# EAGLE design Backplane (EAGLE 9.6.2)
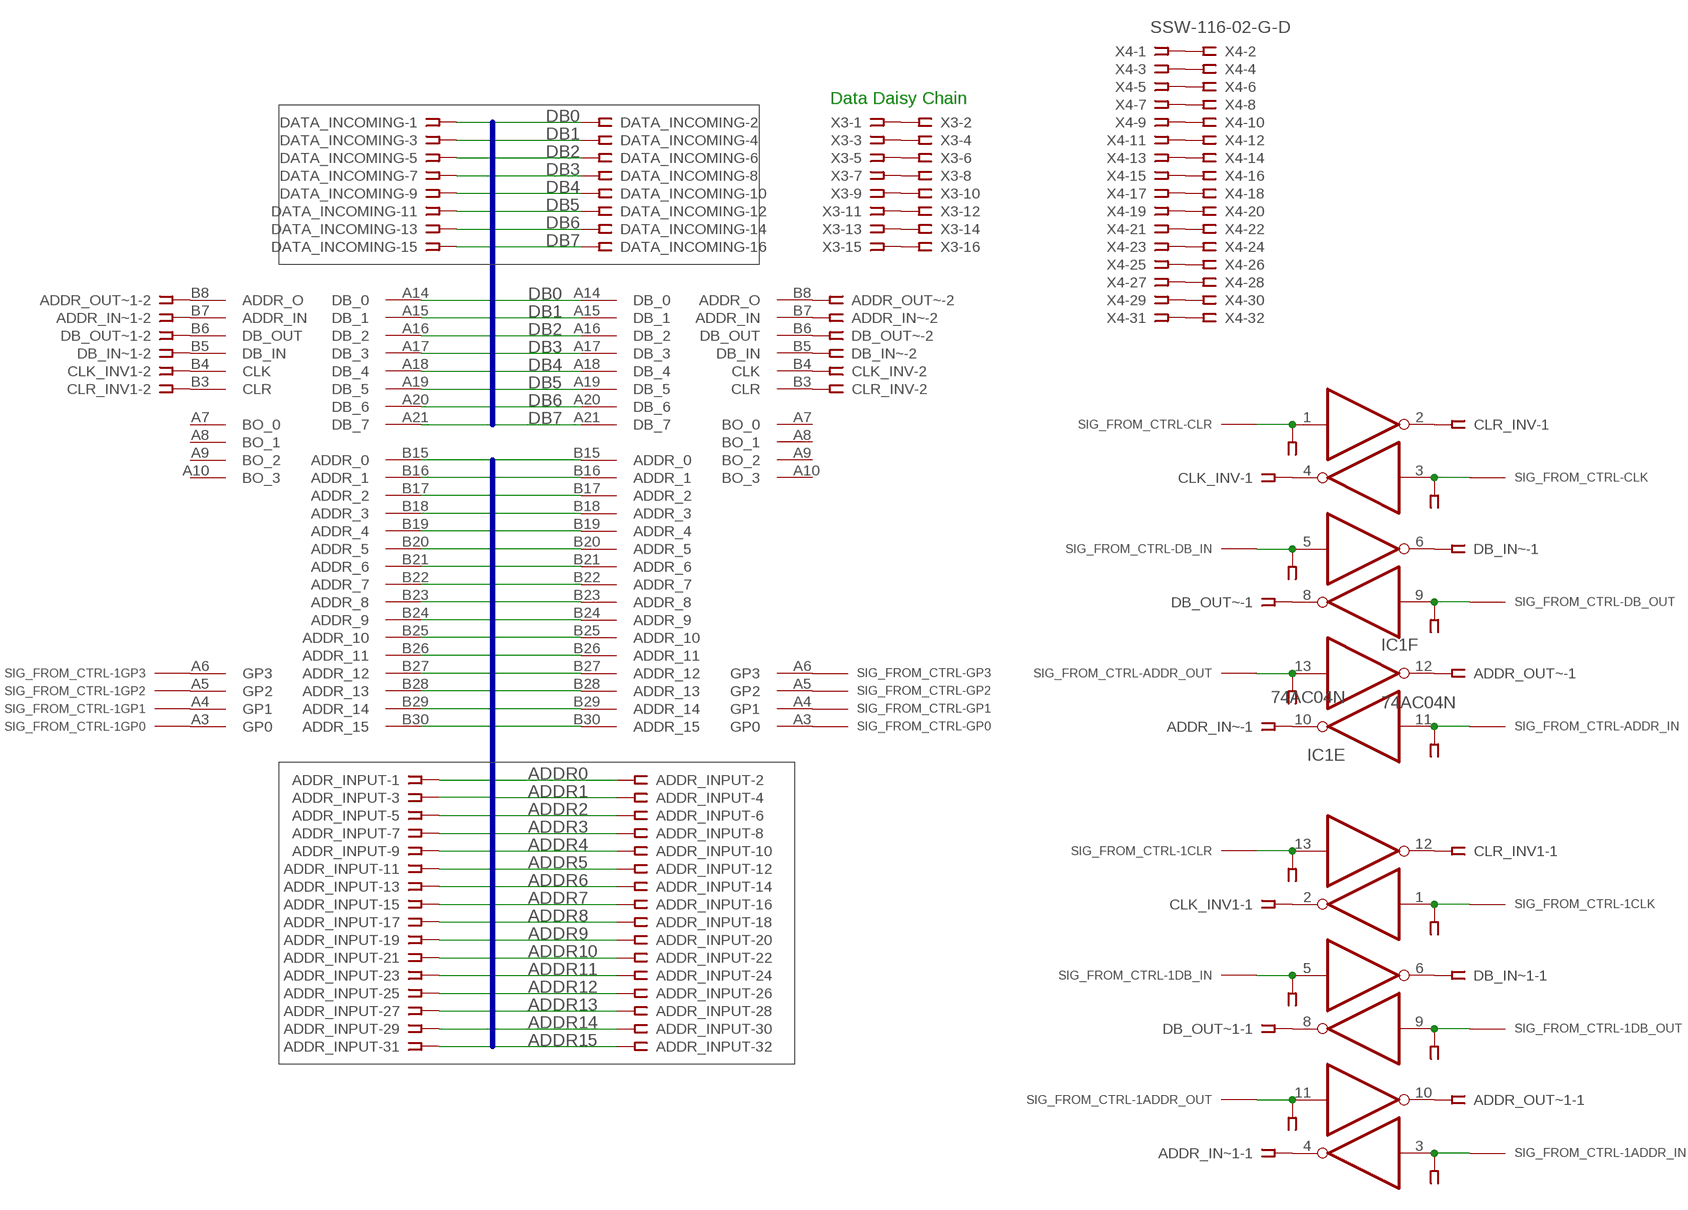
[diagram p0: schematic, sheet 1]

## Parts
ADDR_INPUT  SSW-116-02-G-D  [SSW-116-02-G-D]
ADDR_IN~  SSW-103-02-G-S  [SSW-103-02-G-S]
ADDR_IN~1  SSW-103-02-G-S  [SSW-103-02-G-S]
ADDR_OUT~  SSW-103-02-G-S  [SSW-103-02-G-S]
ADDR_OUT~1  SSW-103-02-G-S  [SSW-103-02-G-S]
CLK_INV  SSW-103-02-G-S  [SSW-103-02-G-S]
CLK_INV1  SSW-103-02-G-S  [SSW-103-02-G-S]
CLR_INV  SSW-103-02-G-S  [SSW-103-02-G-S]
CLR_INV1  SSW-103-02-G-S  [SSW-103-02-G-S]
DATA_INCOMING  SSW-108-02-G-D  [SSW-108-02-G-D]
DB_IN~  SSW-103-02-G-S  [SSW-103-02-G-S]
DB_IN~1  SSW-103-02-G-S  [SSW-103-02-G-S]
DB_OUT~  SSW-103-02-G-S  [SSW-103-02-G-S]
DB_OUT~1  SSW-103-02-G-S  [SSW-103-02-G-S]
IC1  74AC04N  [DIL14]
IC2  74AC04N  [DIL14]
SIG_FROM_CTRL-  CONTROL_SIG-INT  [CONTROL_SIG-INT-FOOT]
SIG_FROM_CTRL-1  CONTROL_SIG-INT  [CONTROL_SIG-INT-FOOT]
U$1  BACKPLATE_INTERFACEHEADER  [PCI_INTERFACE]
U$2  BACKPLATE_INTERFACEHEADER  [PCI_INTERFACE]
X3  SSW-108-02-G-D  [SSW-108-02-G-D]
X4  SSW-116-02-G-D  [SSW-116-02-G-D]

## Nets
ADDR0: ADDR_INPUT.1 ADDR_INPUT.2 U$1.B15(ADDR_0) U$2.B15(ADDR_0)
ADDR1: ADDR_INPUT.3 ADDR_INPUT.4 U$1.B16(ADDR_1) U$2.B16(ADDR_1)
ADDR2: ADDR_INPUT.5 ADDR_INPUT.6 U$1.B17(ADDR_2) U$2.B17(ADDR_2)
ADDR3: ADDR_INPUT.7 ADDR_INPUT.8 U$1.B18(ADDR_3) U$2.B18(ADDR_3)
ADDR4: ADDR_INPUT.9 ADDR_INPUT.10 U$1.B19(ADDR_4) U$2.B19(ADDR_4)
ADDR5: ADDR_INPUT.11 ADDR_INPUT.12 U$1.B20(ADDR_5) U$2.B20(ADDR_5)
ADDR6: ADDR_INPUT.13 ADDR_INPUT.14 U$1.B21(ADDR_6) U$2.B21(ADDR_6)
ADDR7: ADDR_INPUT.15 ADDR_INPUT.16 U$1.B22(ADDR_7) U$2.B22(ADDR_7)
ADDR8: ADDR_INPUT.17 ADDR_INPUT.18 U$1.B23(ADDR_8) U$2.B23(ADDR_8)
ADDR9: ADDR_INPUT.19 ADDR_INPUT.20 U$1.B24(ADDR_9) U$2.B24(ADDR_9)
ADDR10: ADDR_INPUT.21 ADDR_INPUT.22 U$1.B25(ADDR_10) U$2.B25(ADDR_10)
ADDR11: ADDR_INPUT.23 ADDR_INPUT.24 U$1.B26(ADDR_11) U$2.B26(ADDR_11)
ADDR12: ADDR_INPUT.25 ADDR_INPUT.26 U$1.B27(ADDR_12) U$2.B27(ADDR_12)
ADDR13: ADDR_INPUT.27 ADDR_INPUT.28 U$1.B28(ADDR_13) U$2.B28(ADDR_13)
ADDR14: ADDR_INPUT.29 ADDR_INPUT.30 U$1.B29(ADDR_14) U$2.B29(ADDR_14)
ADDR15: ADDR_INPUT.31 ADDR_INPUT.32 U$1.B30(ADDR_15) U$2.B30(ADDR_15)
DB0: DATA_INCOMING.1 DATA_INCOMING.2 U$1.A14(DB_0) U$2.A14(DB_0)
DB1: DATA_INCOMING.3 DATA_INCOMING.4 U$1.A15(DB_1) U$2.A15(DB_1)
DB2: DATA_INCOMING.5 DATA_INCOMING.6 U$1.A16(DB_2) U$2.A16(DB_2)
DB3: DATA_INCOMING.7 DATA_INCOMING.8 U$1.A17(DB_3) U$2.A17(DB_3)
DB4: DATA_INCOMING.9 DATA_INCOMING.10 U$1.A18(DB_4) U$2.A18(DB_4)
DB5: DATA_INCOMING.11 DATA_INCOMING.12 U$1.A19(DB_5) U$2.A19(DB_5)
DB6: DATA_INCOMING.13 DATA_INCOMING.14 U$1.A20(DB_6) U$2.A20(DB_6)
DB7: DATA_INCOMING.15 DATA_INCOMING.16 U$1.A21(DB_7) U$2.A21(DB_7)
N$1: CLR_INV.2 U$2.B3(CLR)
N$2: CLR_INV.3 IC1.1(A:I) SIG_FROM_CTRL-.CLR
N$3: CLK_INV.2 U$2.B4(CLK)
N$4: DB_IN~.2 U$2.B5(DB_IN)
N$5: DB_OUT~.2 U$2.B6(DB_OUT)
N$6: SIG_FROM_CTRL-.GP0 U$2.A3(GP0)
N$7: SIG_FROM_CTRL-.GP1 U$2.A4(GP1)
N$8: CLK_INV.3 IC1.3(B:I) SIG_FROM_CTRL-.CLK
N$9: DB_IN~.3 IC1.5(C:I) SIG_FROM_CTRL-.DB_IN
N$10: DB_OUT~.3 IC1.9(D:I) SIG_FROM_CTRL-.DB_OUT
N$11: SIG_FROM_CTRL-.GP2 U$2.A5(GP2)
N$12: SIG_FROM_CTRL-.GP3 U$2.A6(GP3)
N$13: ADDR_OUT~.3 IC1.13(F:I) SIG_FROM_CTRL-.ADDR_OT
N$14: ADDR_IN~.1 IC1.10(E:O)
N$15: CLR_INV.1 IC1.2(A:O)
N$16: CLK_INV.1 IC1.4(B:O)
N$17: DB_IN~.1 IC1.6(C:O)
N$18: DB_OUT~.1 IC1.8(D:O)
N$19: ADDR_IN~.3 IC1.11(E:I) SIG_FROM_CTRL-.ADDR_IN
N$20: ADDR_OUT~.1 IC1.12(F:O)
N$21: ADDR_OUT~.2 U$2.B8(ADDR_O)
N$22: ADDR_IN~.2 U$2.B7(ADDR_IN)
N$33: X3.1 X3.2
N$34: X3.3 X3.4
N$35: X3.5 X3.6
N$36: X3.7 X3.8
N$37: X3.9 X3.10
N$38: X3.11 X3.12
N$39: X3.13 X3.14
N$40: X3.15 X3.16
N$41: X4.1 X4.2
N$42: X4.3 X4.4
N$43: X4.5 X4.6
N$44: X4.7 X4.8
N$45: X4.9 X4.10
N$46: X4.11 X4.12
N$47: X4.13 X4.14
N$48: X4.15 X4.16
N$49: X4.17 X4.18
N$50: X4.19 X4.20
N$51: X4.21 X4.22
N$52: X4.23 X4.24
N$53: X4.25 X4.26
N$54: X4.27 X4.28
N$55: X4.29 X4.30
N$56: X4.31 X4.32
N$57: CLR_INV1.3 IC2.13(F:I) SIG_FROM_CTRL-1.CLR
N$58: CLK_INV1.3 IC2.1(A:I) SIG_FROM_CTRL-1.CLK
N$59: DB_IN~1.3 IC2.5(C:I) SIG_FROM_CTRL-1.DB_IN
N$60: DB_OUT~1.3 IC2.9(D:I) SIG_FROM_CTRL-1.DB_OUT
N$61: CLK_INV1.1 IC2.2(A:O)
N$62: ADDR_IN~1.1 IC2.4(B:O)
N$63: DB_IN~1.1 IC2.6(C:O)
N$64: DB_OUT~1.1 IC2.8(D:O)
N$65: ADDR_OUT~1.3 IC2.11(E:I) SIG_FROM_CTRL-1.ADDR_OT
N$66: ADDR_IN~1.3 IC2.3(B:I) SIG_FROM_CTRL-1.ADDR_IN
N$67: ADDR_OUT~1.1 IC2.10(E:O)
N$68: CLR_INV1.1 IC2.12(F:O)
N$79: CLK_INV1.2 U$1.B4(CLK)
N$80: CLR_INV1.2 U$1.B3(CLR)
N$81: DB_IN~1.2 U$1.B5(DB_IN)
N$82: DB_OUT~1.2 U$1.B6(DB_OUT)
N$83: ADDR_OUT~1.2 U$1.B8(ADDR_O)
N$84: ADDR_IN~1.2 U$1.B7(ADDR_IN)
N$85: SIG_FROM_CTRL-1.GP0 U$1.A3(GP0)
N$86: SIG_FROM_CTRL-1.GP1 U$1.A4(GP1)
N$87: SIG_FROM_CTRL-1.GP2 U$1.A5(GP2)
N$88: SIG_FROM_CTRL-1.GP3 U$1.A6(GP3)
Unconnected: U$1.A1 U$1.A7(BO_0) U$1.A8(BO_1) U$1.A9(BO_2) U$1.A10(BO_3) U$1.A11 U$1.A12 U$1.A13 U$1.A22 U$1.A23 U$1.A24 U$1.A25 U$1.A26 U$1.A27 U$1.A28 U$1.A29 U$1.A30 U$1.A32 U$1.B1 U$1.B9 U$1.B10 U$1.B11 U$1.B12 U$1.B13 U$1.B14 U$1.B32 U$2.A1 U$2.A7(BO_0) U$2.A8(BO_1) U$2.A9(BO_2) U$2.A10(BO_3) U$2.A11 U$2.A12 U$2.A13 U$2.A22 U$2.A23 U$2.A24 U$2.A25 U$2.A26 U$2.A27 U$2.A28 U$2.A29 U$2.A30 U$2.A32 U$2.B1 U$2.B9 U$2.B10 U$2.B11 U$2.B12 U$2.B13 U$2.B14 U$2.B32

## Buses
DB[0..7]
ADDR[0..15]

## Notes on the sheet
- Data Daisy Chain

## Power pins joined to a net without a drawn wire
GND: IC1.7(P:GND) IC2.7(P:GND) SIG_FROM_CTRL-1.GND SIG_FROM_CTRL-.GND U$1.B2(GND) U$1.B31(GND) U$2.B2(GND) U$2.B31(GND)
VCC: IC1.14(P:VCC) IC2.14(P:VCC) SIG_FROM_CTRL-1.VCC SIG_FROM_CTRL-.VCC U$1.A2(VCC) U$1.A31(VCC) U$2.A2(VCC) U$2.A31(VCC)

## Library data of the parts
ADDR_INPUT X4 = con-samtec:SSW-116-02-G: THROUGH-HOLE .025" SQ POST SOCKET Source: Samtec SSW.pdf; MF: Samtec Inc.; MPN: SSW-116-02-G-D; OC_FARNELL: unknown; OC_NEWARK: 11P9577
ADDR_IN~ ADDR_IN~1 ADDR_OUT~ ADDR_OUT~1 CLK_INV CLK_INV1 CLR_INV CLR_INV1 DB_IN~ DB_IN~1 DB_OUT~ DB_OUT~1 = con-samtec:SSW-103-02-G-S: THROUGH-HOLE .025" SQ POST SOCKET Source: Samtec SSW.pdf; MF: Samtec Inc.; MPN: SSW-103-02-G-S; OC_FARNELL: unknown; OC_NEWARK: 11P9367
DATA_INCOMING X3 = con-samtec:SSW-108-02-G: THROUGH-HOLE .025" SQ POST SOCKET Source: Samtec SSW.pdf; MF: Samtec Inc.; MPN: SSW-108-02-G-D; OC_FARNELL: unknown; OC_NEWARK: 85K7646
IC1 IC2 = 74xx-eu:74*04: Hex INVERTER
SIG_FROM_CTRL- SIG_FROM_CTRL-1 = Computer:CONTROL_SIG-INT
U$1 U$2 = Computer:BACKPLATE_INTERFACE

## Net classes
0 default: width 0.152 mm

## Board
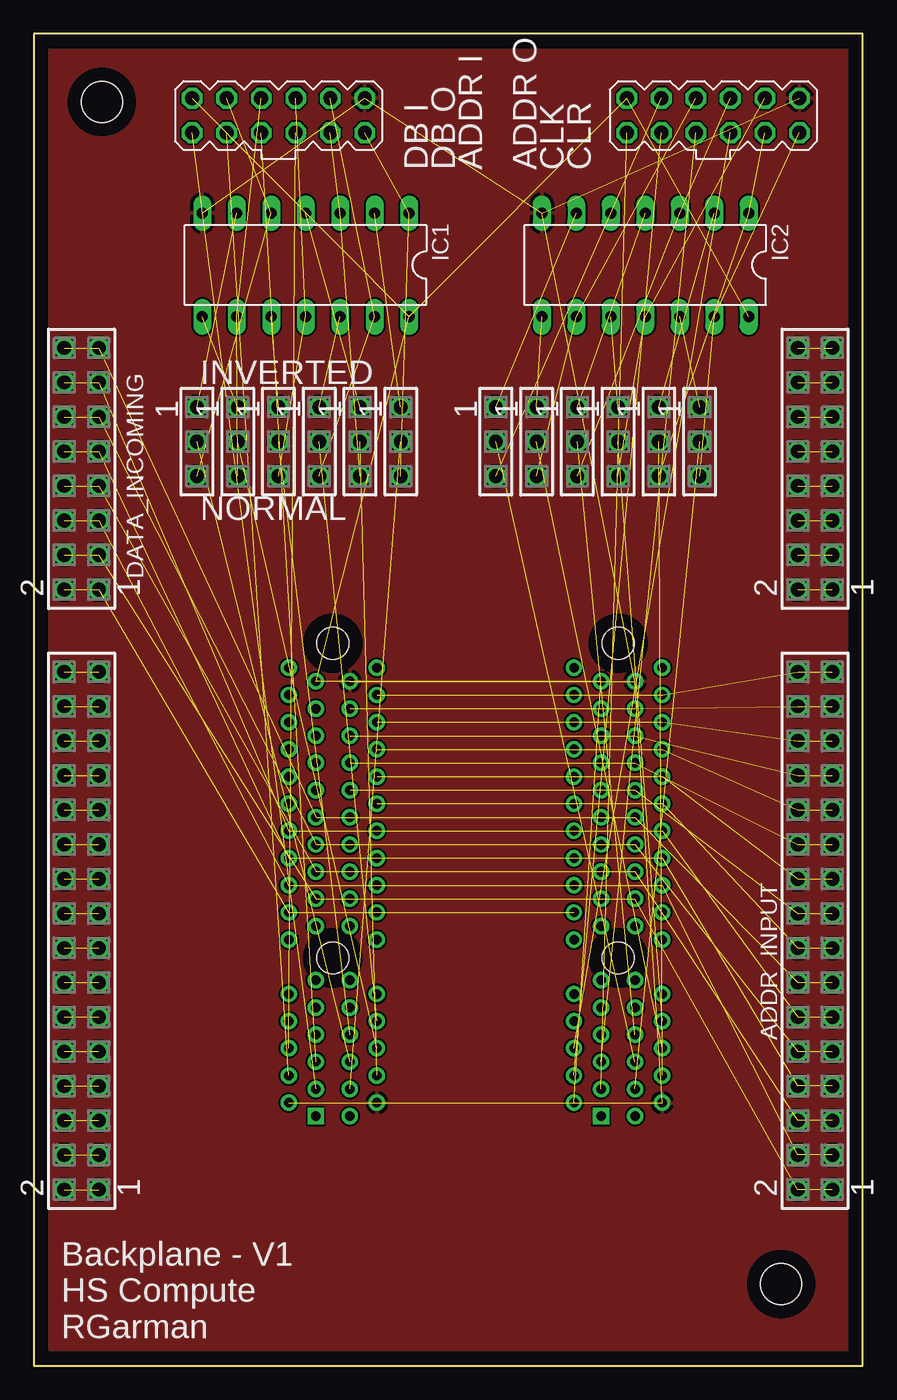
[diagram p1: board, top side]
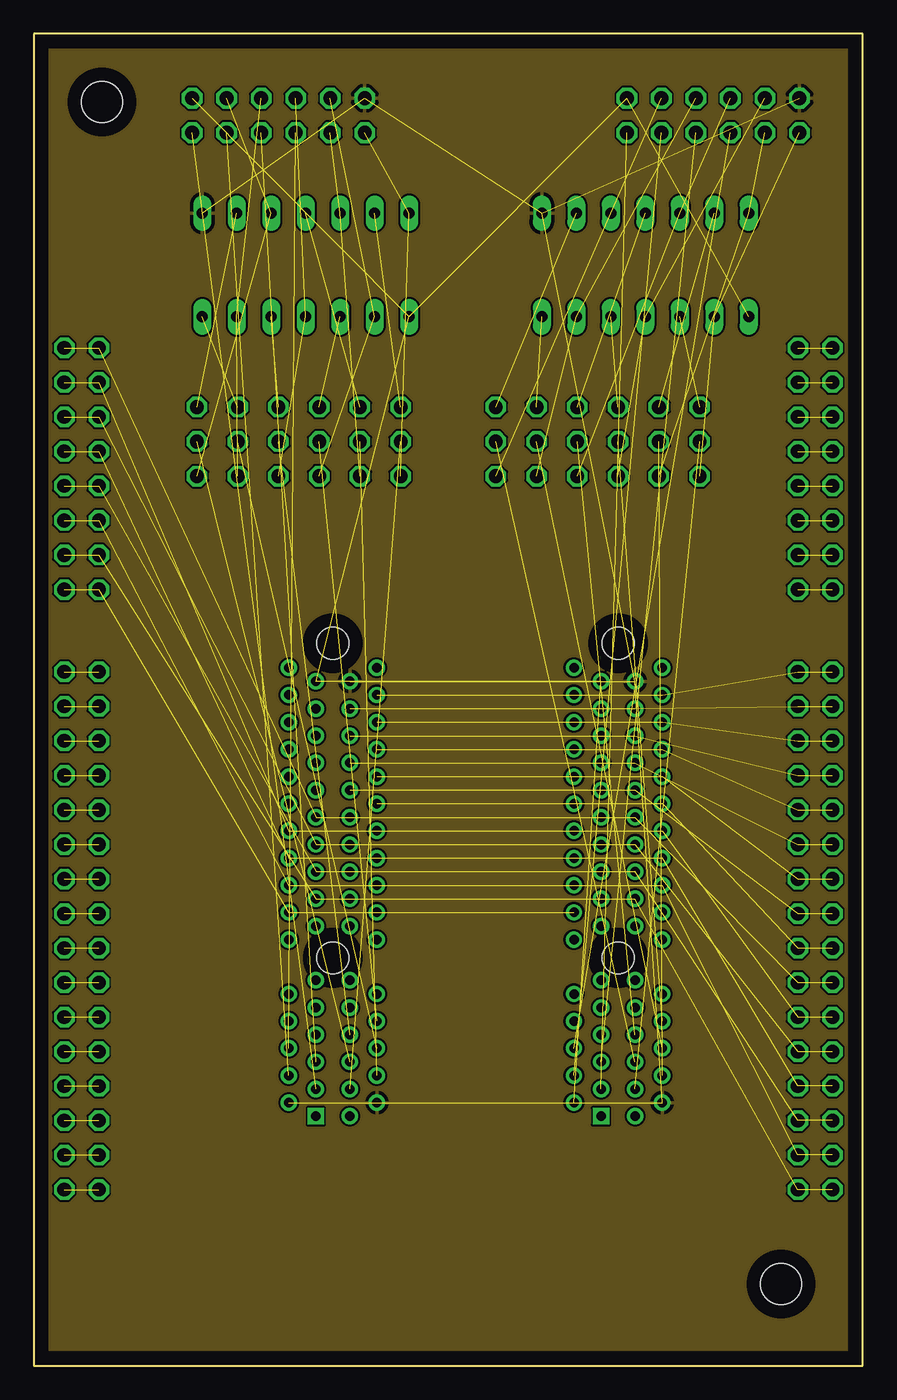
[diagram p2: board, inner layer Route2]
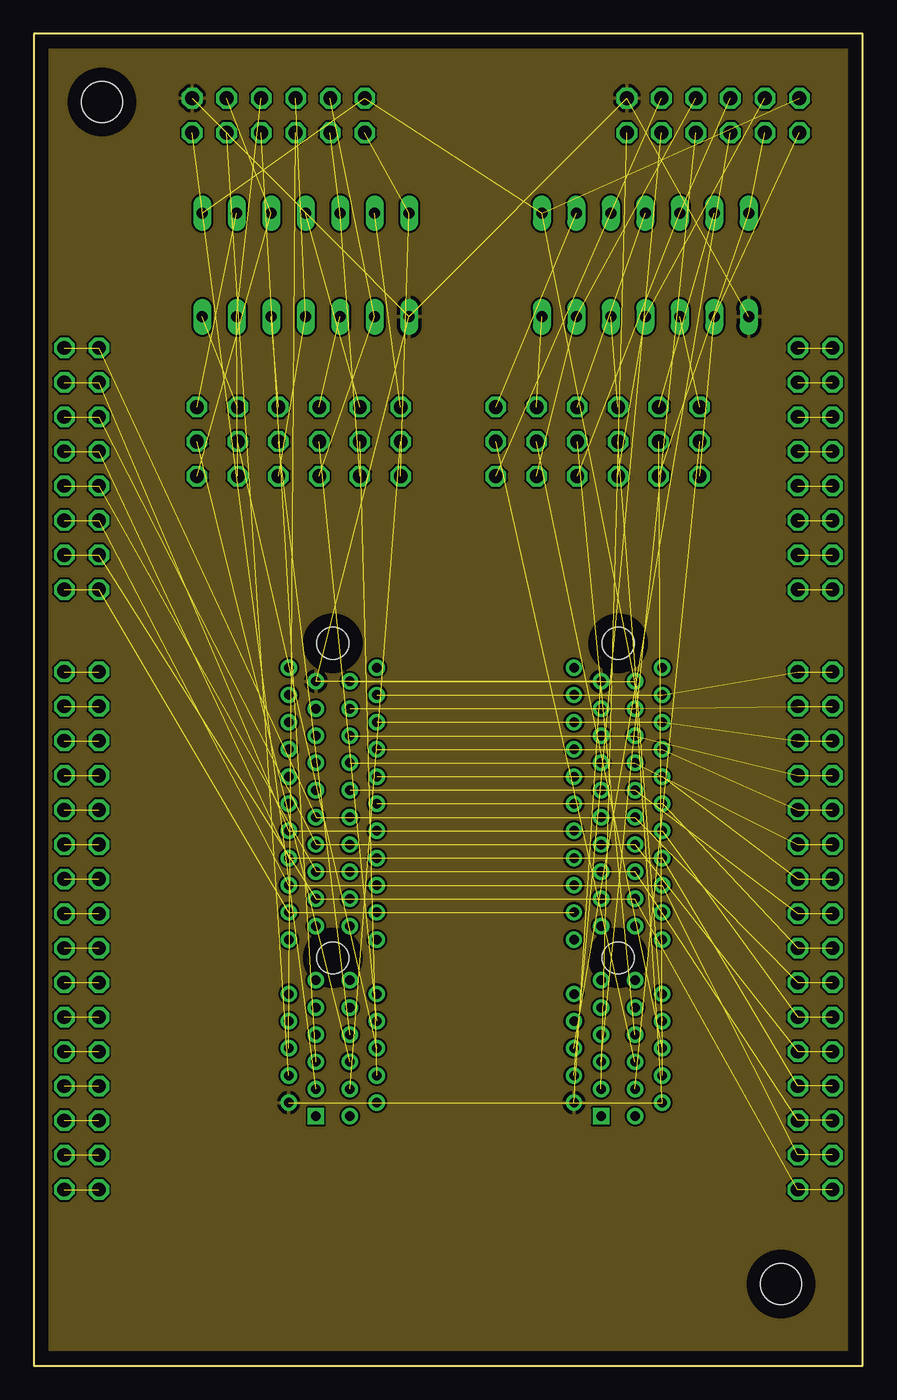
[diagram p3: board, inner layer Route15]
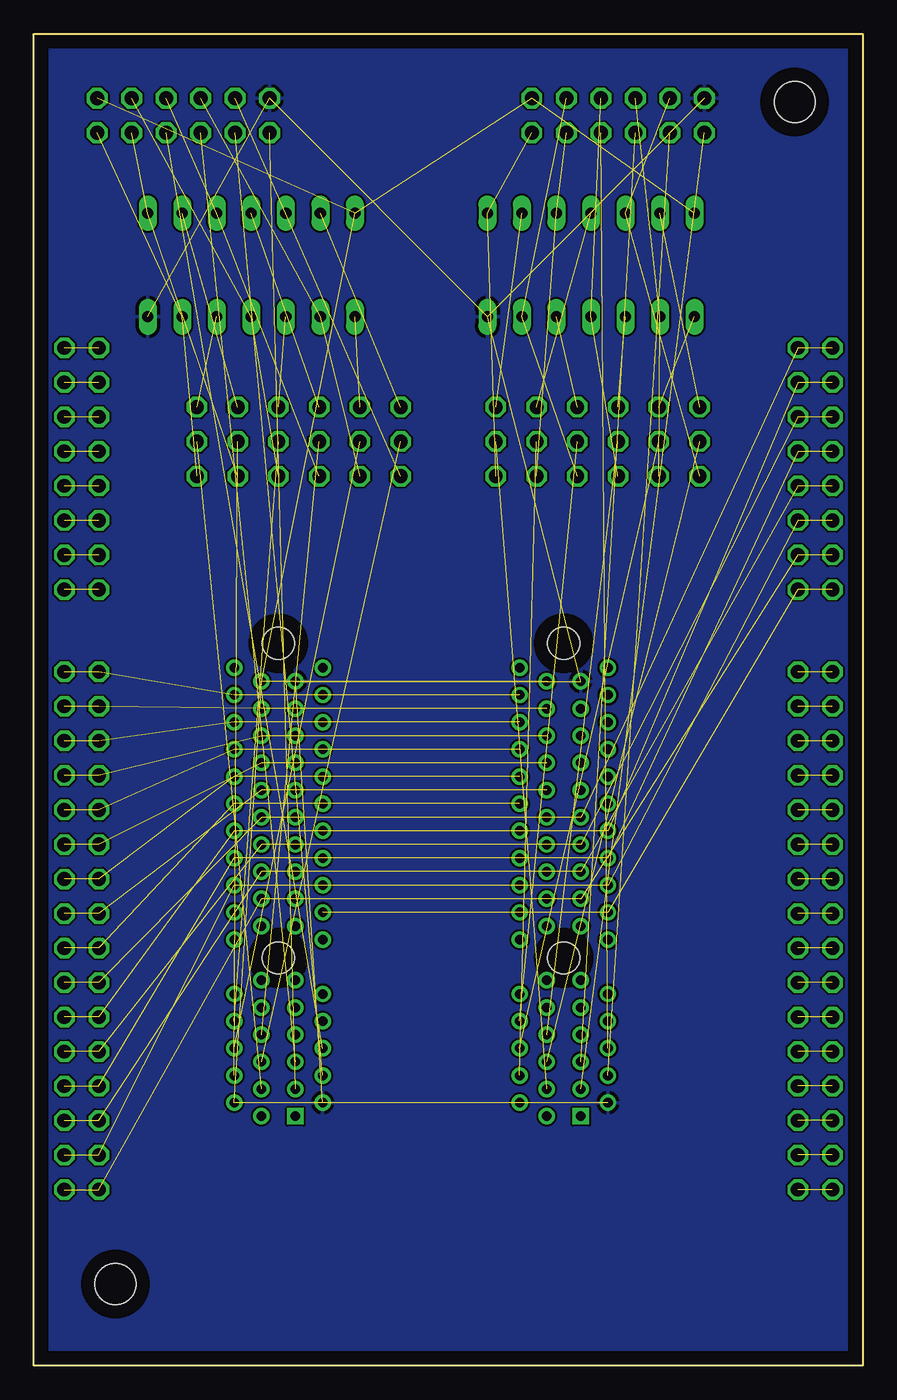
[diagram p4: board, bottom side, seen from below]

Size 61 x 98 mm. Coordinates in mm from the lower left corner, seen from the top.
Outline: 0,0 61,0 61,98 0,98 0,0
Copper layers (1*16): Top 0.035mm / dielectric 1.5mm / Bottom 0.035mm
Design rules "default *": minimum track width 0.2mm, minimum drill 0.35mm, track to track 6mil, track to pad 6mil, pad to pad 6mil, via to via 6mil, smd to smd 6mil, copper to edge 40mil, drill to drill 6mil, minimum pad ring 10mil, minimum via ring 8mil, stop-mask expansion 4mil, vias tented up to drill 0mil, thermal gap 10mil
Holes 3 mm at 5,93 55,6

### Footprints (pad centres in the part's own frame; a part is rotated, then mirrored left to right if it is on the bottom)
SSW-116-02-G-D = drill 1 pad 1.5 octagon: 1 -19.05,-1.27; 2 -19.05,1.27; 3 -16.51,-1.27; 4 -16.51,1.27; 5 -13.97,-1.27; 6 -13.97,1.27; 7 -11.43,-1.27; 8 -11.43,1.27; 9 -8.89,-1.27; 10 -8.89,1.27; 11 -6.35,-1.27; 12 -6.35,1.27; 13 -3.81,-1.27; 14 -3.81,1.27; 15 -1.27,-1.27; 16 -1.27,1.27; 17 1.27,-1.27; 18 1.27,1.27; 19 3.81,-1.27; 20 3.81,1.27; 21 6.35,-1.27; 22 6.35,1.27; 23 8.89,-1.27; 24 8.89,1.27; 25 11.43,-1.27; 26 11.43,1.27; 27 13.97,-1.27; 28 13.97,1.27; 29 16.51,-1.27; 30 16.51,1.27; 31 19.05,-1.27; 32 19.05,1.27
SSW-103-02-G-S = drill 1 pad 1.5 octagon: 1 -2.54,0; 2 0,0; 3 2.54,0
SSW-108-02-G-D = drill 1 pad 1.5 octagon: 1 -8.89,-1.27; 2 -8.89,1.27; 3 -6.35,-1.27; 4 -6.35,1.27; 5 -3.81,-1.27; 6 -3.81,1.27; 7 -1.27,-1.27; 8 -1.27,1.27; 9 1.27,-1.27; 10 1.27,1.27; 11 3.81,-1.27; 12 3.81,1.27; 13 6.35,-1.27; 14 6.35,1.27; 15 8.89,-1.27; 16 8.89,1.27
DIL14 = drill 0.813 long: 1 -7.62,-3.81; 2 -5.08,-3.81; 3 -2.54,-3.81; 4 0,-3.81; 5 2.54,-3.81; 6 5.08,-3.81; 7 7.62,-3.81; 8 7.62,3.81; 9 5.08,3.81; 10 2.54,3.81; 11 0,3.81; 12 -2.54,3.81; 13 -5.08,3.81; 14 -7.62,3.81
CONTROL_SIG-INT-FOOT = drill 1.016 octagon: ADDR_IN 1.27,1.27; ADDR_OT 3.81,1.27; CLK 3.81,-1.27; CLR 6.35,-1.27; DB_IN -3.81,1.27; DB_OUT -1.27,1.27; GND 6.35,1.27; GP0 -6.35,-1.27; GP1 -3.81,-1.27; GP2 -1.27,-1.27; GP3 1.27,-1.27; VCC -6.35,1.27
PCI_INTERFACE = drill 0.7 square: A1 -11.65,1.25 | drill 0.7: A2 -10.65,3.25; A3 -9.65,1.25; A4 -8.65,3.25; A5 -7.65,1.25; A6 -6.65,3.25; A7 -5.65,1.25; A8 -4.65,3.25; A9 -3.65,1.25; A10 -2.65,3.25; A11 -1.65,1.25; A12 1.35,3.25; A13 2.35,1.25; A14 3.35,3.25; A15 4.35,1.25; A16 5.35,3.25; A17 6.35,1.25; A18 7.35,3.25; A19 8.35,1.25; A20 9.35,3.25; A21 10.35,1.25; A22 11.35,3.25; A23 12.35,1.25; A24 13.35,3.25; A25 14.35,1.25; A26 15.35,3.25; A27 16.35,1.25; A28 17.35,3.25; A29 18.35,1.25; A30 19.35,3.25; A31 20.35,1.25; A32 21.35,3.25; B1 -11.65,-1.25; B2 -10.65,-3.25; B3 -9.65,-1.25; B4 -8.65,-3.25; B5 -7.65,-1.25; B6 -6.65,-3.25; B7 -5.65,-1.25; B8 -4.65,-3.25; B9 -3.65,-1.25; B10 -2.65,-3.25; B11 -1.65,-1.25; B12 1.35,-3.25; B13 2.35,-1.25; B14 3.35,-3.25; B15 4.35,-1.25; B16 5.35,-3.25; B17 6.35,-1.25; B18 7.35,-3.25; B19 8.35,-1.25; B20 9.35,-3.25; B21 10.35,-1.25; B22 11.35,-3.25; B23 12.35,-1.25; B24 13.35,-3.25; B25 14.35,-1.25; B26 15.35,-3.25; B27 16.35,-1.25; B28 17.35,-3.25; B29 18.35,-1.25; B30 19.35,-3.25; B31 20.35,-1.25; B32 21.35,-3.25 | hole 2.35: 0,0; 23.15,0

### Placement (x,y rotation side)
ADDR_INPUT  57.5,32 90 top
ADDR_IN~  18,68 270 top
ADDR_IN~1  40,68 270 top
ADDR_OUT~  21,68 270 top
ADDR_OUT~1  43,68 270 top
CLK_INV  24,68 270 top
CLK_INV1  46,68 270 top
CLR_INV  27,68 270 top
CLR_INV1  49,68 270 top
DATA_INCOMING  3.5,66 90 top
DB_IN~  12,68 270 top
DB_IN~1  34,68 270 top
DB_OUT~  15,68 270 top
DB_OUT~1  37,68 270 top
IC1  20,81 180 top
IC2  45,81 180 top
SIG_FROM_CTRL-  18,92 0 top
SIG_FROM_CTRL-1  50,92 0 top
U$1  43,30 90 top
U$2  22,30 90 top
X3  57.5,66 90 top
X4  3.5,32 90 top

### Tracks (layer width: path | path; a pad name or v marks a point on that pad's centre or on a via)
ADDR0  (3 unrouted)
ADDR1  (3 unrouted)
ADDR2  (3 unrouted)
ADDR3  (3 unrouted)
ADDR4  (3 unrouted)
ADDR5  (3 unrouted)
ADDR6  (3 unrouted)
ADDR7  (3 unrouted)
ADDR8  (3 unrouted)
ADDR9  (3 unrouted)
ADDR10  (3 unrouted)
ADDR11  (3 unrouted)
ADDR12  (3 unrouted)
ADDR13  (3 unrouted)
ADDR14  (3 unrouted)
ADDR15  (3 unrouted)
DB0  (3 unrouted)
DB1  (3 unrouted)
DB2  (3 unrouted)
DB3  (3 unrouted)
DB4  (3 unrouted)
DB5  (3 unrouted)
DB6  (3 unrouted)
DB7  (3 unrouted)
GND  (7 unrouted)
  pour Route2: 0,98 61,98 61,0 0,0
  pour Top: 0,98 61,98 61,0 0,0
N$1  (1 unrouted)
N$2  (2 unrouted)
N$3  (1 unrouted)
N$4  (1 unrouted)
N$5  (1 unrouted)
N$6  (1 unrouted)
N$7  (1 unrouted)
N$8  (2 unrouted)
N$9  (2 unrouted)
N$10  (2 unrouted)
N$11  (1 unrouted)
N$12  (1 unrouted)
N$13  (2 unrouted)
N$14  (1 unrouted)
N$15  (1 unrouted)
N$16  (1 unrouted)
N$17  (1 unrouted)
N$18  (1 unrouted)
N$19  (2 unrouted)
N$20  (1 unrouted)
N$21  (1 unrouted)
N$22  (1 unrouted)
N$33  (1 unrouted)
N$34  (1 unrouted)
N$35  (1 unrouted)
N$36  (1 unrouted)
N$37  (1 unrouted)
N$38  (1 unrouted)
N$39  (1 unrouted)
N$40  (1 unrouted)
N$41  (1 unrouted)
N$42  (1 unrouted)
N$43  (1 unrouted)
N$44  (1 unrouted)
N$45  (1 unrouted)
N$46  (1 unrouted)
N$47  (1 unrouted)
N$48  (1 unrouted)
N$49  (1 unrouted)
N$50  (1 unrouted)
N$51  (1 unrouted)
N$52  (1 unrouted)
N$53  (1 unrouted)
N$54  (1 unrouted)
N$55  (1 unrouted)
N$56  (1 unrouted)
N$57  (2 unrouted)
N$58  (2 unrouted)
N$59  (2 unrouted)
N$60  (2 unrouted)
N$61  (1 unrouted)
N$62  (1 unrouted)
N$63  (1 unrouted)
N$64  (1 unrouted)
N$65  (2 unrouted)
N$66  (2 unrouted)
N$67  (1 unrouted)
N$68  (1 unrouted)
N$79  (1 unrouted)
N$80  (1 unrouted)
N$81  (1 unrouted)
N$82  (1 unrouted)
N$83  (1 unrouted)
N$84  (1 unrouted)
N$85  (1 unrouted)
N$86  (1 unrouted)
N$87  (1 unrouted)
N$88  (1 unrouted)
VCC  (7 unrouted)
  pour Route15: 0,98 61,98 61,0 0,0
  pour Bottom: 0,98 61,98 61,0 0,0

### Text on the board
tNames: DB I | DB O | ADDR I | ADDR O | CLK | CLR | INVERTED | NORMAL | Backplane - V1 / HS Compute / RGarman